# Altium schematic sheet Ethernet_Switch.SchDoc: Ethernet Switch
size A; Revision: 1
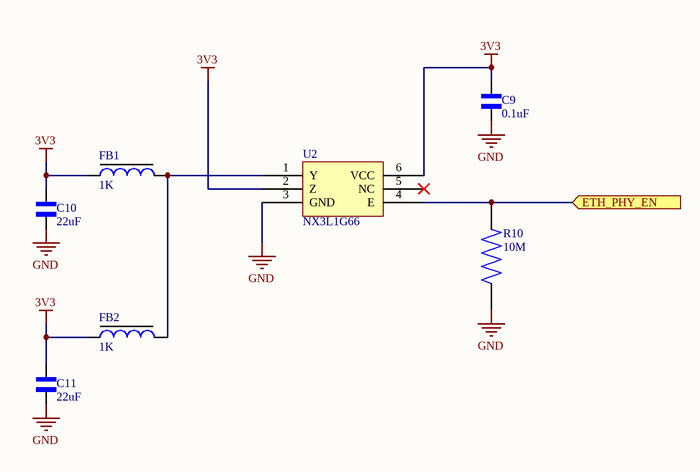
[diagram p0: Ethernet_Switch.SchDoc]

## Parts
C9  0.1uF  [C0402]
C10  22uF  [C0603]
C11  22uF  [C0603]
FB1  1K  [FB0402]
FB2  1K  [FB0402]
R10  10M  [R0402 Vishay]
U2  NX3L1G66  [PSON50P145X100X50-6N]

## Ports
ETH_PHY_EN (in)

## Nets
3V3: C9.2 C10.2 C11.2 FB1.1 FB2.1 U2.2(Z) U2.6(VCC)
GND: C9.1 C10.1 C11.1 R10.1 U2.3(GND)
ETH_PHY_EN: R10.2 U2.4(E) ; port ETH_PHY_EN
NetFB1_2: FB1.2 FB2.2 U2.1(Y)

Not connected (* = marked no-connect by the designer): U2 5(NC)*

## Library data of the parts
C9 = GRM022R60J104KE15L: CAP CER 0.1UF 6.3V X5R 01005; Manufacturer: Murata; Capacitance: 100nF; Tolerance: 10%; Supplier 1: Digi-Key; Manufacturer Part Number: GRM022R60J104KE15L; RoHS: No; Category: Ceramic Capacitors; Stock 1: 633064; Pricing 1: 1=0.13000, 10=0.09000, 50=0.05080, 100=0.04210, 500=0.02952, 1000=0.02444, 2500=0.02275, 5000=0.02081 (USD); Mount: Surface Mount; Case Code (Imperial): 1005; Case Code (Metric): 0402; Min Operating Temperature: -55°C; Max Operating Temperature: 85°C; Packaging: Cut Tape; Voltage Rating: 6.3V; ComponentLink1URL: http://search.murata.co.jp/Ceramy/image/img/A01X/G101/ENG/GRM022R60J104KE15-01.pdf?src-supplier=Digi-Key; ComponentLink1Description: http://search.murata.co.jp/Ceramy/image/img/A01X/G101/ENG/GRM022R60J104KE15-01.pdf?src-supplier=Digi-Key; Supplier Part Number 1: 490-16598-1-ND
C10 C11 = ZRB18AR61A226ME01L: 0603 22 uF 10 V ±20% Tolerance X5R Surface Mount Multilayer Ceramic Capacitor; Manufacturer: Murata; Voltage Rating: 10V; Supplier 1: Mouser; Manufacturer Part Number: ZRB18AR61A226ME01L; RoHS: No; Category: Ceramic Capacitors; Stock 1: 179696; Pricing 1: 1=0.44000, 10=0.30400, 100=0.18300, 500=0.13700, 1000=0.11600, 3000=0.09500 (USD); Mount: Surface Mount; Case/Package: 0603; Min Operating Temperature: -55°C; Max Operating Temperature: 85°C; Packaging: Tape and Reel; Capacitance: 22uF; Tolerance: 20%; ComponentLink1URL: http://search.murata.co.jp/Ceramy/image/img/A01X/G101/ENG/ZRB18AR61A226ME01-02.pdf?src-supplier=Digi-Key; ComponentLink1Description: http://search.murata.co.jp/Ceramy/image/img/A01X/G101/ENG/ZRB18AR61A226ME01-02.pdf?src-supplier=Digi-Key; Supplier Part Number 1: 81-ZRB18AR61A226ME1L
FB1 FB2 = BLM15AG102SH1D: FERRITE BEAD 1 KOHM 0402 1LN; Manufacturer: Murata; Impedance: 1kR; Tolerance: 25%; Max DC Current: 200mA; DC Resistance (DCR): 1R; Test Frequency: 100MHz; Number of Lines: 1; Supplier 1: Digi-Key; Manufacturer Part Number: BLM15AG102SH1D; RoHS: Yes; Category: Ferrite Beads and Chips; Stock 1: 79326; Pricing 1: 1=0.11000, 10=0.09300, 25=0.08320, 50=0.06100, 100=0.05270, 250=0.04164, 500=0.03516, 1000=0.02960, 5000=0.02636 (USD); Mount: Surface Mount; Case/Package: 0402; Core Material: Ferrite; Case Code (Metric): 1005; Case Code (Imperial): 0402; Min Operating Temperature: -55°C; Max Operating Temperature: 125°C; Packaging: Tape and Reel; Package Quantity: 10000; Termination: SMD/SMT; Max Current Rating: 200mA; Number of Circuits: 1; Length: 0.039inch; Width: 0.5mm; Height: 0.022inch; Depth: 0.55mm; Ratings: AEC-Q200; REACH SVHC: No SVHC; ComponentLink1URL: https://datasheet.ciiva.com/29364/l0132s0193blm15a-sh-29364285.pdf?src-supplier=Digi-Key; ComponentLink1Description: https://datasheet.ciiva.com/29364/l0132s0193blm15a-sh-29364285.pdf?src-supplier=Digi-Key; ComponentLink2URL: https://datasheet.ciiva.com/17279/l0132s0193blm15a-sh-17279626.pdf?src-supplier=Avnet+Europe; ComponentLink2Description: https://datasheet.ciiva.com/17279/l0132s0193blm15a-sh-17279626.pdf?src-supplier=Avnet+Europe; ComponentLink3URL: https://datasheet.ciiva.com/8510/l0132s0193blm15a-sh-8510171.pdf?src-supplier=Avnet; ComponentLink3Description: https://datasheet.ciiva.com/8510/l0132s0193blm15a-sh-8510171.pdf?src-supplier=Avnet; ComponentLink4URL: https://datasheet.ciiva.com/29364/l0132s0193blm15a-sh-29364283.pdf?src-supplier=Digi-Key; ComponentLink4Description: https://datasheet.ciiva.com/29364/l0132s0193blm15a-sh-29364283.pdf?src-supplier=Digi-Key; ComponentLink5URL: https://datasheet.ciiva.com/29364/l0132s0193blm15a-sh-29364286.pdf?src-supplier=Digi-Key; ComponentLink5Description: https://datasheet.ciiva.com/29364/l0132s0193blm15a-sh-29364286.pdf?src-supplier=Digi-Key; Supplier Part Number 1: 490-7804-1-ND
R10 = CRCW040210M0FKED: RESISTOR, 0402, 10M, 1%, FULL REEL; Product Range:VISHAY - AEC-Q200 CRCW Series; Resistance:10Mohm; Power Rating:63mW; Resistance Tolerance:± 1%; Resistor Case Style:0402 [1005 Metric]; Resistor Element Material:Thick Film; ;RoHS Compliant: Yes; Manufacturer: Vishay; Resistance: 10MR; Temperature Coefficient: 100ppm/°C; Max Power Dissipation: 63mW; Voltage Rating: 50V; Supplier 1: Digi-Key; Manufacturer Part Number: CRCW040210M0FKED; RoHS: Yes; Category: Chip SMD Resistors; Stock 1: 167645; Pricing 1: 1=0.10000, 10=0.03300, 100=0.01330, 1000=0.00596, 2500=0.00518, 5000=0.00428 (USD); Mount: Surface Mount; Case/Package: 0402; Case Code (Metric): 1005; Case Code (Imperial): 0402; Weight: 2.3E-05oz; Contact Plating: Tin; Min Operating Temperature: -55°C; Max Operating Temperature: 155°C; Resistor Type: Thick Film; Tolerance: 1%; Packaging: Tape and Reel; Number of Terminations: 2; Power Rating: 63mW; Package Quantity: 10; Termination: SMD/SMT; Voltage Rating (DC): 50V; Features: Automotive AEC-Q200; Length: 1mm; Width: 0.02inch; Height: 0.35mm; Depth: 0.5mm; Radiation Hardening: No; REACH SVHC: Unknown; Military Standard: Not; Lead Free: Lead Free; ComponentLink1URL: https://datasheet.ciiva.com/11811/0900766b80d98824-11811586.pdf?src-supplier=RSComponents; ComponentLink1Description: https://datasheet.ciiva.com/11811/0900766b80d98824-11811586.pdf?src-supplier=RSComponents; ComponentLink2URL: https://datasheet.ciiva.com/2463/dcrcwe3-2463089.pdf?src-supplier=Digi-Key; ComponentLink2Description: https://datasheet.ciiva.com/2463/dcrcwe3-2463089.pdf?src-supplier=Digi-Key; ComponentLink3URL: https://datasheet.ciiva.com/2463/dcrcwe3-2463088.pdf?src-supplier=Digi-Key; ComponentLink3Description: https://datasheet.ciiva.com/2463/dcrcwe3-2463088.pdf?src-supplier=Digi-Key; ComponentLink4URL: https://datasheet.ciiva.com/2463/dcrcwe3-2463090.pdf?src-supplier=Digi-Key; ComponentLink4Description: https://datasheet.ciiva.com/2463/dcrcwe3-2463090.pdf?src-supplier=Digi-Key; ComponentLink5URL: https://datasheet.ciiva.com/5552/dcrcwe3-109170-5552597.pdf?src-supplier=Mouser; ComponentLink5Description: https://datasheet.ciiva.com/5552/dcrcwe3-109170-5552597.pdf?src-supplier=Mouser; ComponentLink6URL: https://datasheet.ciiva.com/16881/dcrcwe3-16881451.pdf?src-supplier=Avnet+Europe; ComponentLink6Description: https://datasheet.ciiva.com/16881/dcrcwe3-16881451.pdf?src-supplier=Avnet+Europe; ComponentLink7URL: https://datasheet.ciiva.com/26316/fld-crcw-e3-data-en-26316614.pdf?src-supplier=Distrelec; ComponentLink7Description: https://datasheet.ciiva.com/26316/fld-crcw-e3-data-en-26316614.pdf?src-supplier=Distrelec; ComponentLink8URL: https://datasheet.ciiva.com/16773/70201119-16773258.pdf?src-supplier=Allied+Electronics; ComponentLink8Description: https://datasheet.ciiva.com/16773/70201119-16773258.pdf?src-supplier=Allied+Electronics; Supplier Part Number 1: 541-10.0MLCT-ND
U2 = NX3L1G66: Single pole Single Throw switch